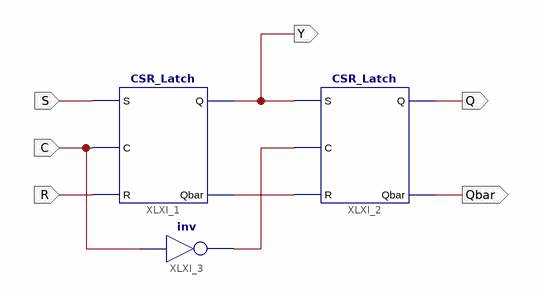
[diagram p0: schematic sheet 1]
// Xilinx ISE schematic MS_FlipFlop.sch (kintex7) as structural Verilog: 3 symbols, 6 ports
module MS_FlipFlop (
  input  S,
  input  C,
  input  R,
  output Y,
  output Q,
  output Qbar
);

  wire XLXN_5, XLXN_6;

  CSR_Latch XLXI_1 (.S(S), .C(C), .R(R), .Q(Y), .Qbar(XLXN_5));
  CSR_Latch XLXI_2 (.S(Y), .C(XLXN_6), .R(XLXN_5), .Q(Q), .Qbar(Qbar));
  not XLXI_3 (XLXN_6, C);
endmodule
